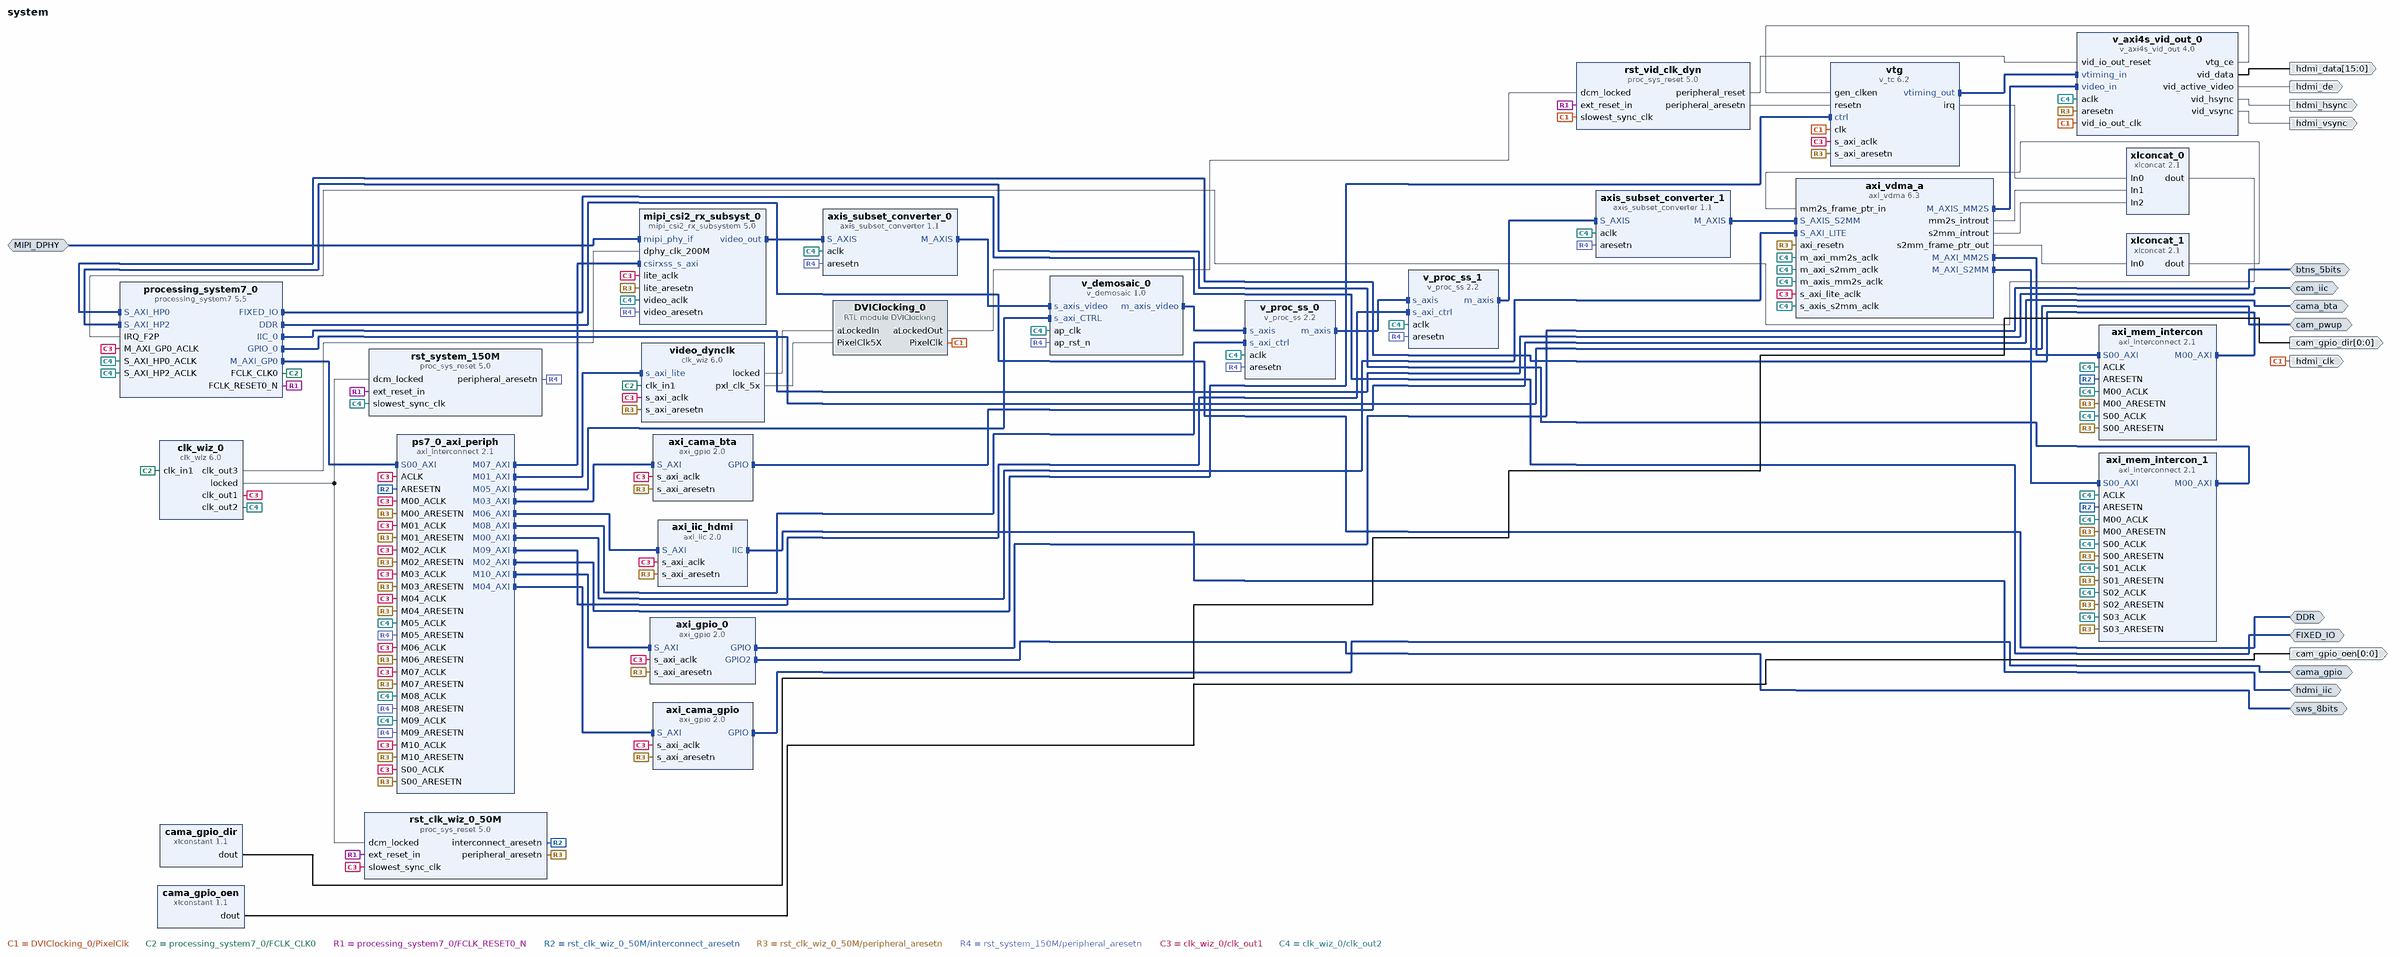
[diagram p0: block diagram of the top level]
# Vivado block design system, xc7z020clg484-1, Vivado 2020.1
create_bd_design system

create_bd_intf_port -mode Master -vlnv xilinx.com:interface:ddrx_rtl:1.0 DDR
create_bd_intf_port -mode Master -vlnv xilinx.com:display_processing_system7:fixedio_rtl:1.0 FIXED_IO
create_bd_intf_port -mode Master -vlnv xilinx.com:interface:iic_rtl:1.0 cam_iic
create_bd_intf_port -mode Master -vlnv xilinx.com:interface:gpio_rtl:1.0 cam_pwup
create_bd_intf_port -mode Master -vlnv xilinx.com:interface:gpio_rtl:1.0 cama_bta
create_bd_intf_port -mode Master -vlnv xilinx.com:interface:gpio_rtl:1.0 cama_gpio
create_bd_intf_port -mode Master -vlnv xilinx.com:interface:iic_rtl:1.0 hdmi_iic
create_bd_intf_port -mode Slave -vlnv xilinx.com:interface:mipi_phy_rtl:1.0 MIPI_DPHY
create_bd_intf_port -mode Master -vlnv xilinx.com:interface:gpio_rtl:1.0 btns_5bits
create_bd_intf_port -mode Master -vlnv xilinx.com:interface:gpio_rtl:1.0 sws_8bits
create_bd_port -dir O -from 0 -to 0 cam_gpio_dir
create_bd_port -dir O -from 0 -to 0 cam_gpio_oen
create_bd_port -dir O -from 15 -to 0 hdmi_data
create_bd_port -dir O hdmi_de
create_bd_port -dir O hdmi_hsync
create_bd_port -dir O hdmi_vsync
create_bd_port -dir O hdmi_clk

create_bd_cell -type module -reference DVIClocking DVIClocking_0
create_bd_cell -type ip -vlnv xilinx.com:ip:processing_system7:5.5 processing_system7_0
set_property -dict [list \
  CONFIG.PCW_APU_PERIPHERAL_FREQMHZ 666.666667 \
  CONFIG.PCW_ENET0_ENET0_IO {MIO 16 .. 27} \
  CONFIG.PCW_ENET0_GRP_MDIO_ENABLE 1 \
  CONFIG.PCW_ENET0_GRP_MDIO_IO {MIO 52 .. 53} \
  CONFIG.PCW_ENET0_PERIPHERAL_ENABLE 1 \
  CONFIG.PCW_ENET_RESET_ENABLE 0 \
  CONFIG.PCW_FPGA0_PERIPHERAL_FREQMHZ 100.000000 \
  CONFIG.PCW_FPGA1_PERIPHERAL_FREQMHZ 150.000000 \
  CONFIG.PCW_GPIO_EMIO_GPIO_ENABLE 1 \
  CONFIG.PCW_GPIO_EMIO_GPIO_IO 2 \
  CONFIG.PCW_GPIO_EMIO_GPIO_WIDTH 2 \
  CONFIG.PCW_GPIO_MIO_GPIO_ENABLE 1 \
  CONFIG.PCW_GPIO_MIO_GPIO_IO MIO \
  CONFIG.PCW_I2C0_I2C0_IO EMIO \
  CONFIG.PCW_I2C0_PERIPHERAL_ENABLE 1 \
  CONFIG.PCW_I2C_PERIPHERAL_FREQMHZ 111.111115 \
  CONFIG.PCW_I2C_RESET_ENABLE 0 \
  CONFIG.PCW_IRQ_F2P_INTR 1 \
  CONFIG.PCW_PERIPHERAL_BOARD_PRESET part0 \
  CONFIG.PCW_PRESET_BANK1_VOLTAGE {LVCMOS 1.8V} \
  CONFIG.PCW_QSPI_GRP_SINGLE_SS_ENABLE 1 \
  CONFIG.PCW_QSPI_GRP_SINGLE_SS_IO {MIO 1 .. 6} \
  CONFIG.PCW_QSPI_PERIPHERAL_ENABLE 1 \
  CONFIG.PCW_QSPI_QSPI_IO {MIO 1 .. 6} \
  CONFIG.PCW_SD0_GRP_CD_ENABLE 1 \
  CONFIG.PCW_SD0_GRP_CD_IO {MIO 47} \
  CONFIG.PCW_SD0_GRP_WP_ENABLE 1 \
  CONFIG.PCW_SD0_GRP_WP_IO {MIO 46} \
  CONFIG.PCW_SD0_PERIPHERAL_ENABLE 1 \
  CONFIG.PCW_SD0_SD0_IO {MIO 40 .. 45} \
  CONFIG.PCW_SDIO_PERIPHERAL_FREQMHZ 100 \
  CONFIG.PCW_SINGLE_QSPI_DATA_MODE x4 \
  CONFIG.PCW_UART1_PERIPHERAL_ENABLE 1 \
  CONFIG.PCW_UART1_UART1_IO {MIO 48 .. 49} \
  CONFIG.PCW_UART_PERIPHERAL_FREQMHZ 50 \
  CONFIG.PCW_UIPARAM_DDR_FREQ_MHZ 533.333313 \
  CONFIG.PCW_UIPARAM_DDR_PARTNO {MT41J128M16 HA-15E} \
  CONFIG.PCW_USB0_PERIPHERAL_ENABLE 1 \
  CONFIG.PCW_USB0_RESET_ENABLE 0 \
  CONFIG.PCW_USB0_USB0_IO {MIO 28 .. 39} \
  CONFIG.PCW_USB_RESET_ENABLE 1 \
  CONFIG.PCW_USB_RESET_SELECT {Share reset pin} \
  CONFIG.PCW_USE_FABRIC_INTERRUPT 1 \
  CONFIG.PCW_USE_S_AXI_HP0 1 \
  CONFIG.PCW_USE_S_AXI_HP2 1 \
  CONFIG.preset ZedBoard \
] [get_bd_cells processing_system7_0]
# 516 more settings of processing_system7_0 are not shown: defaults, MIO pin electricals, DDR timing, and values the tool derives
create_bd_cell -type ip -vlnv xilinx.com:ip:proc_sys_reset:5.0 rst_clk_wiz_0_50M
create_bd_cell -type ip -vlnv xilinx.com:ip:proc_sys_reset:5.0 rst_system_150M
create_bd_cell -type ip -vlnv xilinx.com:ip:proc_sys_reset:5.0 rst_vid_clk_dyn
create_bd_cell -type ip -vlnv xilinx.com:ip:v_axi4s_vid_out:4.0 v_axi4s_vid_out_0
set_property -dict [list \
  CONFIG.C_ADDR_WIDTH 12 \
  CONFIG.C_HAS_ASYNC_CLK 1 \
  CONFIG.C_S_AXIS_VIDEO_FORMAT 0 \
  CONFIG.C_VTG_MASTER_SLAVE 1 \
] [get_bd_cells v_axi4s_vid_out_0]
create_bd_cell -type ip -vlnv xilinx.com:ip:xlconcat:2.1 xlconcat_0
set_property -dict {CONFIG.NUM_PORTS 6 CONFIG.dout_width 6} [get_bd_cells xlconcat_0]
create_bd_cell -type ip -vlnv xilinx.com:ip:xlconcat:2.1 xlconcat_1
set_property -dict {CONFIG.NUM_PORTS 4 CONFIG.dout_width 24} [get_bd_cells xlconcat_1]
create_bd_cell -type ip -vlnv xilinx.com:ip:axi_gpio:2.0 axi_cama_bta
set_property -dict {CONFIG.C_GPIO_WIDTH 4} [get_bd_cells axi_cama_bta]
create_bd_cell -type ip -vlnv xilinx.com:ip:axi_gpio:2.0 axi_cama_gpio
set_property -dict {CONFIG.C_GPIO_WIDTH 4} [get_bd_cells axi_cama_gpio]
create_bd_cell -type ip -vlnv xilinx.com:ip:axi_interconnect:2.1 axi_mem_intercon
set_property -dict {CONFIG.NUM_MI 1 CONFIG.SYNCHRONIZATION_STAGES 2} [get_bd_cells axi_mem_intercon]
create_bd_cell -type ip -vlnv xilinx.com:ip:axi_interconnect:2.1 axi_mem_intercon_1
set_property -dict {CONFIG.NUM_MI 1 CONFIG.NUM_SI 4 CONFIG.SYNCHRONIZATION_STAGES 2} [get_bd_cells axi_mem_intercon_1]
create_bd_cell -type ip -vlnv xilinx.com:ip:axi_vdma:6.3 axi_vdma_a
set_property -dict [list \
  CONFIG.c_enable_mm2s_frmstr_reg 1 \
  CONFIG.c_enable_s2mm_frmstr_reg 1 \
  CONFIG.c_enable_s2mm_sts_reg 1 \
  CONFIG.c_include_mm2s_dre 0 \
  CONFIG.c_include_s2mm 1 \
  CONFIG.c_m_axi_s2mm_data_width 64 \
  CONFIG.c_m_axis_mm2s_tdata_width 16 \
  CONFIG.c_mm2s_genlock_mode 1 \
  CONFIG.c_mm2s_genlock_num_masters 4 \
  CONFIG.c_mm2s_linebuffer_depth 1024 \
  CONFIG.c_num_fstores 3 \
  CONFIG.c_s2mm_genlock_mode 0 \
  CONFIG.c_s2mm_linebuffer_depth 1024 \
] [get_bd_cells axi_vdma_a]
create_bd_cell -type ip -vlnv xilinx.com:ip:xlconstant:1.1 cama_gpio_dir
create_bd_cell -type ip -vlnv xilinx.com:ip:xlconstant:1.1 cama_gpio_oen
set_property -dict {CONFIG.CONST_VAL 0} [get_bd_cells cama_gpio_oen]
create_bd_cell -type ip -vlnv xilinx.com:ip:clk_wiz:6.0 clk_wiz_0
set_property -dict [list \
  CONFIG.CLKOUT1_DRIVES BUFG \
  CONFIG.CLKOUT1_JITTER 174.353 \
  CONFIG.CLKOUT1_PHASE_ERROR 132.063 \
  CONFIG.CLKOUT1_REQUESTED_OUT_FREQ 50 \
  CONFIG.CLKOUT2_DRIVES BUFG \
  CONFIG.CLKOUT2_JITTER 139.594 \
  CONFIG.CLKOUT2_PHASE_ERROR 132.063 \
  CONFIG.CLKOUT2_REQUESTED_OUT_FREQ 150 \
  CONFIG.CLKOUT2_USED true \
  CONFIG.CLKOUT3_DRIVES BUFG \
  CONFIG.CLKOUT3_JITTER 132.221 \
  CONFIG.CLKOUT3_PHASE_ERROR 132.063 \
  CONFIG.CLKOUT3_REQUESTED_OUT_FREQ 200 \
  CONFIG.CLKOUT3_USED true \
  CONFIG.CLKOUT4_DRIVES BUFG \
  CONFIG.CLKOUT5_DRIVES BUFG \
  CONFIG.CLKOUT6_DRIVES BUFG \
  CONFIG.CLKOUT7_DRIVES BUFG \
  CONFIG.CLK_OUT2_PORT clk_out2 \
  CONFIG.CLK_OUT3_PORT clk_out3 \
  CONFIG.MMCM_CLKFBOUT_MULT_F 6.000 \
  CONFIG.MMCM_CLKIN1_PERIOD 10.0 \
  CONFIG.MMCM_CLKIN2_PERIOD 10.0 \
  CONFIG.MMCM_CLKOUT0_DIVIDE_F 12.000 \
  CONFIG.MMCM_CLKOUT1_DIVIDE 4 \
  CONFIG.MMCM_CLKOUT2_DIVIDE 3 \
  CONFIG.MMCM_DIVCLK_DIVIDE 1 \
  CONFIG.NUM_OUT_CLKS 3 \
  CONFIG.PRIM_SOURCE Global_buffer \
  CONFIG.RESET_PORT reset \
  CONFIG.RESET_TYPE ACTIVE_HIGH \
  CONFIG.SECONDARY_SOURCE Single_ended_clock_capable_pin \
  CONFIG.USE_PHASE_ALIGNMENT false \
  CONFIG.USE_RESET false \
] [get_bd_cells clk_wiz_0]
create_bd_cell -type ip -vlnv xilinx.com:ip:axi_interconnect:2.1 ps7_0_axi_periph
set_property -dict [list \
  CONFIG.M06_HAS_REGSLICE 0 \
  CONFIG.M16_HAS_REGSLICE 0 \
  CONFIG.M17_HAS_REGSLICE 0 \
  CONFIG.M18_HAS_REGSLICE 0 \
  CONFIG.NUM_MI 11 \
  CONFIG.S00_HAS_REGSLICE 4 \
  CONFIG.SYNCHRONIZATION_STAGES 2 \
] [get_bd_cells ps7_0_axi_periph]
create_bd_cell -type ip -vlnv xilinx.com:ip:clk_wiz:6.0 video_dynclk
set_property -dict [list \
  CONFIG.CLKOUT1_DRIVES No_buffer \
  CONFIG.CLKOUT1_JITTER 232.529 \
  CONFIG.CLKOUT1_PHASE_ERROR 322.999 \
  CONFIG.CLKOUT1_REQUESTED_OUT_FREQ 742.5 \
  CONFIG.CLKOUT2_DRIVES BUFG \
  CONFIG.CLKOUT3_DRIVES BUFG \
  CONFIG.CLKOUT4_DRIVES BUFG \
  CONFIG.CLKOUT5_DRIVES BUFG \
  CONFIG.CLKOUT6_DRIVES BUFG \
  CONFIG.CLKOUT7_DRIVES BUFG \
  CONFIG.CLK_OUT1_PORT pxl_clk_5x \
  CONFIG.FEEDBACK_SOURCE FDBK_ONCHIP \
  CONFIG.MMCM_CLKFBOUT_MULT_F 37.125 \
  CONFIG.MMCM_CLKIN1_PERIOD 10.000 \
  CONFIG.MMCM_CLKIN2_PERIOD 10.000 \
  CONFIG.MMCM_CLKOUT0_DIVIDE_F 1.000 \
  CONFIG.MMCM_DIVCLK_DIVIDE 5 \
  CONFIG.PRIM_SOURCE No_buffer \
  CONFIG.SECONDARY_SOURCE Single_ended_clock_capable_pin \
  CONFIG.USE_DYN_RECONFIG true \
  CONFIG.USE_FREQ_SYNTH true \
  CONFIG.USE_PHASE_ALIGNMENT false \
] [get_bd_cells video_dynclk]
create_bd_cell -type ip -vlnv xilinx.com:ip:v_tc:6.2 vtg
set_property -dict {CONFIG.VIDEO_MODE 1080p CONFIG.enable_detection false} [get_bd_cells vtg]
create_bd_cell -type ip -vlnv xilinx.com:ip:axi_iic:2.0 axi_iic_hdmi
create_bd_cell -type ip -vlnv xilinx.com:ip:axis_subset_converter:1.1 axis_subset_converter_0
set_property -dict [list \
  CONFIG.M_TDATA_NUM_BYTES 1 \
  CONFIG.M_TDEST_WIDTH 1 \
  CONFIG.S_TDATA_NUM_BYTES 2 \
  CONFIG.TDATA_REMAP {tdata[9:2]} \
  CONFIG.TDEST_REMAP {tdest[0:0]} \
] [get_bd_cells axis_subset_converter_0]
create_bd_cell -type ip -vlnv xilinx.com:ip:mipi_csi2_rx_subsystem:5.0 mipi_csi2_rx_subsyst_0
set_property -dict [list \
  CONFIG.CMN_NUM_LANES 2 \
  CONFIG.CMN_PXL_FORMAT RAW10 \
  CONFIG.C_DPHY_LANES 2 \
  CONFIG.C_HS_LINE_RATE 420 \
  CONFIG.C_HS_SETTLE_NS 158 \
  CONFIG.DPY_EN_REG_IF true \
  CONFIG.DPY_LINE_RATE 420 \
] [get_bd_cells mipi_csi2_rx_subsyst_0]
create_bd_cell -type ip -vlnv xilinx.com:ip:v_demosaic:1.0 v_demosaic_0
set_property -dict {CONFIG.ALGORITHM 1 CONFIG.ENABLE_ZIPPER_REMOVAL false} [get_bd_cells v_demosaic_0]
create_bd_cell -type ip -vlnv xilinx.com:ip:v_proc_ss:2.2 v_proc_ss_0
set_property -dict [list \
  CONFIG.C_COLORSPACE_SUPPORT 2 \
  CONFIG.C_CSC_ENABLE_WINDOW false \
  CONFIG.C_MAX_DATA_WIDTH 8 \
  CONFIG.C_SAMPLES_PER_CLK 1 \
  CONFIG.C_TOPOLOGY 3 \
] [get_bd_cells v_proc_ss_0]
create_bd_cell -type ip -vlnv xilinx.com:ip:v_proc_ss:2.2 v_proc_ss_1
set_property -dict [list \
  CONFIG.C_H_CHROMA_ALGORITHM 0 \
  CONFIG.C_MAX_DATA_WIDTH 8 \
  CONFIG.C_SAMPLES_PER_CLK 1 \
  CONFIG.C_TOPOLOGY 5 \
] [get_bd_cells v_proc_ss_1]
create_bd_cell -type ip -vlnv xilinx.com:ip:axis_subset_converter:1.1 axis_subset_converter_1
set_property -dict [list \
  CONFIG.M_TDATA_NUM_BYTES 2 \
  CONFIG.S_TDATA_NUM_BYTES 3 \
  CONFIG.TDATA_REMAP {tdata[15:0]} \
] [get_bd_cells axis_subset_converter_1]
create_bd_cell -type ip -vlnv xilinx.com:ip:axi_gpio:2.0 axi_gpio_0
set_property -dict [list \
  CONFIG.GPIO2_BOARD_INTERFACE sws_8bits \
  CONFIG.GPIO_BOARD_INTERFACE btns_5bits \
  CONFIG.USE_BOARD_FLOW true \
] [get_bd_cells axi_gpio_0]

# ---- connections ----

connect_bd_intf_net [get_bd_intf_pins ps7_0_axi_periph/M06_AXI] [get_bd_intf_pins axi_iic_hdmi/S_AXI]
connect_bd_intf_net [get_bd_intf_ports cama_bta] [get_bd_intf_pins axi_cama_bta/GPIO]
connect_bd_intf_net [get_bd_intf_pins axi_vdma_a/S_AXI_LITE] [get_bd_intf_pins ps7_0_axi_periph/M00_AXI]
connect_bd_intf_net [get_bd_intf_pins axis_subset_converter_1/M_AXIS] [get_bd_intf_pins axi_vdma_a/S_AXIS_S2MM]
connect_bd_intf_net [get_bd_intf_pins axis_subset_converter_0/M_AXIS] [get_bd_intf_pins v_demosaic_0/s_axis_video]
connect_bd_intf_net [get_bd_intf_ports FIXED_IO] [get_bd_intf_pins processing_system7_0/FIXED_IO]
connect_bd_intf_net [get_bd_intf_pins mipi_csi2_rx_subsyst_0/video_out] [get_bd_intf_pins axis_subset_converter_0/S_AXIS]
connect_bd_intf_net [get_bd_intf_pins ps7_0_axi_periph/M03_AXI] [get_bd_intf_pins axi_cama_bta/S_AXI]
connect_bd_intf_net -intf_net axi_vdma_0_M_AXI_S2MM [get_bd_intf_pins axi_mem_intercon_1/S00_AXI] [get_bd_intf_pins axi_vdma_a/M_AXI_S2MM]
connect_bd_intf_net [get_bd_intf_pins v_proc_ss_1/s_axi_ctrl] [get_bd_intf_pins ps7_0_axi_periph/M09_AXI]
connect_bd_intf_net [get_bd_intf_ports DDR] [get_bd_intf_pins processing_system7_0/DDR]
connect_bd_intf_net [get_bd_intf_pins v_proc_ss_0/s_axi_ctrl] [get_bd_intf_pins ps7_0_axi_periph/M08_AXI]
connect_bd_intf_net [get_bd_intf_ports cam_iic] [get_bd_intf_pins processing_system7_0/IIC_0]
connect_bd_intf_net -intf_net axi_vdma_0_M_AXI_MM2S [get_bd_intf_pins axi_mem_intercon/S00_AXI] [get_bd_intf_pins axi_vdma_a/M_AXI_MM2S]
connect_bd_intf_net [get_bd_intf_pins axi_mem_intercon/M00_AXI] [get_bd_intf_pins processing_system7_0/S_AXI_HP0]
connect_bd_intf_net -intf_net v_tc_0_vtiming_out [get_bd_intf_pins v_axi4s_vid_out_0/vtiming_in] [get_bd_intf_pins vtg/vtiming_out]
connect_bd_intf_net -intf_net axi_iic_0_IIC [get_bd_intf_ports hdmi_iic] [get_bd_intf_pins axi_iic_hdmi/IIC]
connect_bd_intf_net [get_bd_intf_ports cam_pwup] [get_bd_intf_pins processing_system7_0/GPIO_0]
connect_bd_intf_net -intf_net axi_vdma_0_M_AXIS_MM2S [get_bd_intf_pins axi_vdma_a/M_AXIS_MM2S] [get_bd_intf_pins v_axi4s_vid_out_0/video_in]
connect_bd_intf_net [get_bd_intf_pins ps7_0_axi_periph/M04_AXI] [get_bd_intf_pins axi_cama_gpio/S_AXI]
connect_bd_intf_net [get_bd_intf_pins processing_system7_0/M_AXI_GP0] [get_bd_intf_pins ps7_0_axi_periph/S00_AXI]
connect_bd_intf_net [get_bd_intf_pins axi_mem_intercon_1/M00_AXI] [get_bd_intf_pins processing_system7_0/S_AXI_HP2]
connect_bd_intf_net [get_bd_intf_pins ps7_0_axi_periph/M01_AXI] [get_bd_intf_pins video_dynclk/s_axi_lite]
connect_bd_intf_net [get_bd_intf_pins v_demosaic_0/s_axi_CTRL] [get_bd_intf_pins ps7_0_axi_periph/M05_AXI]
connect_bd_intf_net [get_bd_intf_pins v_proc_ss_1/m_axis] [get_bd_intf_pins axis_subset_converter_1/S_AXIS]
connect_bd_intf_net [get_bd_intf_pins v_demosaic_0/m_axis_video] [get_bd_intf_pins v_proc_ss_0/s_axis]
connect_bd_intf_net [get_bd_intf_pins ps7_0_axi_periph/M07_AXI] [get_bd_intf_pins mipi_csi2_rx_subsyst_0/csirxss_s_axi]
connect_bd_intf_net [get_bd_intf_pins ps7_0_axi_periph/M02_AXI] [get_bd_intf_pins vtg/ctrl]
connect_bd_intf_net [get_bd_intf_pins v_proc_ss_0/m_axis] [get_bd_intf_pins v_proc_ss_1/s_axis]
connect_bd_intf_net [get_bd_intf_ports cama_gpio] [get_bd_intf_pins axi_cama_gpio/GPIO]
connect_bd_intf_net -intf_net mipi_phy_if_0_1 [get_bd_intf_ports MIPI_DPHY] [get_bd_intf_pins mipi_csi2_rx_subsyst_0/mipi_phy_if]
connect_bd_intf_net [get_bd_intf_pins ps7_0_axi_periph/M10_AXI] [get_bd_intf_pins axi_gpio_0/S_AXI]
connect_bd_intf_net [get_bd_intf_ports btns_5bits] [get_bd_intf_pins axi_gpio_0/GPIO]
connect_bd_intf_net [get_bd_intf_ports sws_8bits] [get_bd_intf_pins axi_gpio_0/GPIO2]
connect_bd_net [get_bd_pins DVIClocking_0/aLockedOut] [get_bd_pins rst_vid_clk_dyn/dcm_locked]
connect_bd_net -net PixelClk_Generator_clk_out1 [get_bd_pins DVIClocking_0/PixelClk] \
  [get_bd_pins rst_vid_clk_dyn/slowest_sync_clk] [get_bd_pins v_axi4s_vid_out_0/vid_io_out_clk] [get_bd_pins vtg/clk] \
  [get_bd_ports hdmi_clk]
connect_bd_net -net axi_vdma_0_mm2s_introut [get_bd_pins axi_vdma_a/mm2s_introut] [get_bd_pins xlconcat_0/In1]
connect_bd_net -net axi_vdma_0_s2mm_introut [get_bd_pins axi_vdma_a/s2mm_introut] [get_bd_pins xlconcat_0/In2]
connect_bd_net [get_bd_pins axi_vdma_a/s2mm_frame_ptr_out] [get_bd_pins xlconcat_1/In0]
connect_bd_net [get_bd_pins cama_gpio_dir/dout] [get_bd_ports cam_gpio_dir]
connect_bd_net [get_bd_pins cama_gpio_oen/dout] [get_bd_ports cam_gpio_oen]
connect_bd_net [get_bd_pins clk_wiz_0/locked] [get_bd_pins rst_clk_wiz_0_50M/dcm_locked] [get_bd_pins rst_system_150M/dcm_locked]
connect_bd_net -net clk_wiz_1_locked [get_bd_pins video_dynclk/locked] [get_bd_pins DVIClocking_0/aLockedIn]
connect_bd_net -net clk_wiz_1_pxl_clk_5x [get_bd_pins video_dynclk/pxl_clk_5x] [get_bd_pins DVIClocking_0/PixelClk5X]
connect_bd_net [get_bd_pins processing_system7_0/FCLK_CLK0] [get_bd_pins clk_wiz_0/clk_in1] [get_bd_pins video_dynclk/clk_in1]
connect_bd_net [get_bd_pins processing_system7_0/FCLK_RESET0_N] \
  [get_bd_pins rst_clk_wiz_0_50M/ext_reset_in] [get_bd_pins rst_system_150M/ext_reset_in] \
  [get_bd_pins rst_vid_clk_dyn/ext_reset_in]
connect_bd_net [get_bd_pins rst_clk_wiz_0_50M/interconnect_aresetn] \
  [get_bd_pins axi_mem_intercon/ARESETN] [get_bd_pins axi_mem_intercon_1/ARESETN] [get_bd_pins ps7_0_axi_periph/ARESETN]
connect_bd_net [get_bd_pins rst_clk_wiz_0_50M/peripheral_aresetn] \
  [get_bd_pins v_axi4s_vid_out_0/aresetn] [get_bd_pins axi_cama_bta/s_axi_aresetn] [get_bd_pins axi_cama_gpio/s_axi_aresetn] \
  [get_bd_pins axi_mem_intercon/S00_ARESETN] [get_bd_pins axi_mem_intercon/M00_ARESETN] \
  [get_bd_pins axi_mem_intercon_1/S00_ARESETN] [get_bd_pins axi_mem_intercon_1/S01_ARESETN] \
  [get_bd_pins axi_mem_intercon_1/S02_ARESETN] [get_bd_pins axi_mem_intercon_1/S03_ARESETN] \
  [get_bd_pins axi_mem_intercon_1/M00_ARESETN] [get_bd_pins axi_vdma_a/axi_resetn] [get_bd_pins ps7_0_axi_periph/S00_ARESETN] \
  [get_bd_pins ps7_0_axi_periph/M00_ARESETN] [get_bd_pins ps7_0_axi_periph/M01_ARESETN] \
  [get_bd_pins ps7_0_axi_periph/M02_ARESETN] [get_bd_pins ps7_0_axi_periph/M03_ARESETN] \
  [get_bd_pins ps7_0_axi_periph/M04_ARESETN] [get_bd_pins video_dynclk/s_axi_aresetn] [get_bd_pins vtg/s_axi_aresetn] \
  [get_bd_pins axi_iic_hdmi/s_axi_aresetn] [get_bd_pins ps7_0_axi_periph/M06_ARESETN] \
  [get_bd_pins mipi_csi2_rx_subsyst_0/lite_aresetn] [get_bd_pins ps7_0_axi_periph/M07_ARESETN] \
  [get_bd_pins axi_gpio_0/s_axi_aresetn] [get_bd_pins ps7_0_axi_periph/M10_ARESETN]
connect_bd_net [get_bd_pins rst_system_150M/peripheral_aresetn] \
  [get_bd_pins axis_subset_converter_0/aresetn] [get_bd_pins ps7_0_axi_periph/M05_ARESETN] \
  [get_bd_pins mipi_csi2_rx_subsyst_0/video_aresetn] [get_bd_pins v_demosaic_0/ap_rst_n] [get_bd_pins v_proc_ss_0/aresetn] \
  [get_bd_pins v_proc_ss_1/aresetn] [get_bd_pins ps7_0_axi_periph/M08_ARESETN] [get_bd_pins ps7_0_axi_periph/M09_ARESETN] \
  [get_bd_pins axis_subset_converter_1/aresetn]
connect_bd_net [get_bd_pins rst_vid_clk_dyn/peripheral_aresetn] [get_bd_pins vtg/resetn]
connect_bd_net [get_bd_pins rst_vid_clk_dyn/peripheral_reset] [get_bd_pins v_axi4s_vid_out_0/vid_io_out_reset]
connect_bd_net -net s_axil_clk_50 [get_bd_pins clk_wiz_0/clk_out1] \
  [get_bd_pins processing_system7_0/M_AXI_GP0_ACLK] [get_bd_pins rst_clk_wiz_0_50M/slowest_sync_clk] \
  [get_bd_pins axi_cama_bta/s_axi_aclk] [get_bd_pins axi_cama_gpio/s_axi_aclk] [get_bd_pins axi_vdma_a/s_axi_lite_aclk] \
  [get_bd_pins ps7_0_axi_periph/ACLK] [get_bd_pins ps7_0_axi_periph/S00_ACLK] [get_bd_pins ps7_0_axi_periph/M00_ACLK] \
  [get_bd_pins ps7_0_axi_periph/M01_ACLK] [get_bd_pins ps7_0_axi_periph/M02_ACLK] [get_bd_pins ps7_0_axi_periph/M03_ACLK] \
  [get_bd_pins ps7_0_axi_periph/M04_ACLK] [get_bd_pins video_dynclk/s_axi_aclk] [get_bd_pins vtg/s_axi_aclk] \
  [get_bd_pins axi_iic_hdmi/s_axi_aclk] [get_bd_pins ps7_0_axi_periph/M06_ACLK] \
  [get_bd_pins mipi_csi2_rx_subsyst_0/lite_aclk] [get_bd_pins ps7_0_axi_periph/M07_ACLK] [get_bd_pins axi_gpio_0/s_axi_aclk] \
  [get_bd_pins ps7_0_axi_periph/M10_ACLK]
connect_bd_net [get_bd_pins v_axi4s_vid_out_0/vtg_ce] [get_bd_pins vtg/gen_clken]
connect_bd_net -net v_tc_0_irq [get_bd_pins vtg/irq] [get_bd_pins xlconcat_0/In0]
connect_bd_net [get_bd_pins xlconcat_0/dout] [get_bd_pins processing_system7_0/IRQ_F2P]
connect_bd_net [get_bd_pins xlconcat_1/dout] [get_bd_pins axi_vdma_a/mm2s_frame_ptr_in]
connect_bd_net [get_bd_pins v_axi4s_vid_out_0/vid_data] [get_bd_ports hdmi_data]
connect_bd_net [get_bd_pins v_axi4s_vid_out_0/vid_active_video] [get_bd_ports hdmi_de]
connect_bd_net [get_bd_pins v_axi4s_vid_out_0/vid_hsync] [get_bd_ports hdmi_hsync]
connect_bd_net [get_bd_pins v_axi4s_vid_out_0/vid_vsync] [get_bd_ports hdmi_vsync]
connect_bd_net [get_bd_pins clk_wiz_0/clk_out3] [get_bd_pins mipi_csi2_rx_subsyst_0/dphy_clk_200M]
connect_bd_net -net mm_clk_150 [get_bd_pins clk_wiz_0/clk_out2] \
  [get_bd_pins processing_system7_0/S_AXI_HP0_ACLK] [get_bd_pins processing_system7_0/S_AXI_HP2_ACLK] \
  [get_bd_pins rst_system_150M/slowest_sync_clk] [get_bd_pins v_axi4s_vid_out_0/aclk] [get_bd_pins axi_mem_intercon/ACLK] \
  [get_bd_pins axi_mem_intercon/S00_ACLK] [get_bd_pins axi_mem_intercon/M00_ACLK] [get_bd_pins axi_mem_intercon_1/ACLK] \
  [get_bd_pins axi_mem_intercon_1/S00_ACLK] [get_bd_pins axi_mem_intercon_1/S01_ACLK] \
  [get_bd_pins axi_mem_intercon_1/S02_ACLK] [get_bd_pins axi_mem_intercon_1/S03_ACLK] \
  [get_bd_pins axi_mem_intercon_1/M00_ACLK] [get_bd_pins axi_vdma_a/m_axi_mm2s_aclk] \
  [get_bd_pins axi_vdma_a/m_axis_mm2s_aclk] [get_bd_pins axi_vdma_a/m_axi_s2mm_aclk] \
  [get_bd_pins axi_vdma_a/s_axis_s2mm_aclk] [get_bd_pins axis_subset_converter_0/aclk] \
  [get_bd_pins ps7_0_axi_periph/M05_ACLK] [get_bd_pins mipi_csi2_rx_subsyst_0/video_aclk] [get_bd_pins v_demosaic_0/ap_clk] \
  [get_bd_pins v_proc_ss_0/aclk] [get_bd_pins v_proc_ss_1/aclk] [get_bd_pins ps7_0_axi_periph/M08_ACLK] \
  [get_bd_pins ps7_0_axi_periph/M09_ACLK] [get_bd_pins axis_subset_converter_1/aclk]

# ---- address map ----
assign_bd_address -offset 0x00000000 -range 512M -target_address_space [get_bd_addr_spaces axi_vdma_a/Data_MM2S] [get_bd_addr_segs processing_system7_0/S_AXI_HP0/HP0_DDR_LOWOCM]
assign_bd_address -offset 0x00000000 -range 512M -target_address_space [get_bd_addr_spaces axi_vdma_a/Data_S2MM] [get_bd_addr_segs processing_system7_0/S_AXI_HP2/HP2_DDR_LOWOCM]
assign_bd_address -offset 0x41200000 -range 64K -target_address_space [get_bd_addr_spaces processing_system7_0/Data] [get_bd_addr_segs axi_cama_bta/S_AXI/Reg]
assign_bd_address -offset 0x41210000 -range 64K -target_address_space [get_bd_addr_spaces processing_system7_0/Data] [get_bd_addr_segs axi_cama_gpio/S_AXI/Reg]
assign_bd_address -offset 0x41220000 -range 64K -target_address_space [get_bd_addr_spaces processing_system7_0/Data] [get_bd_addr_segs axi_gpio_0/S_AXI/Reg]
assign_bd_address -offset 0x41600000 -range 64K -target_address_space [get_bd_addr_spaces processing_system7_0/Data] [get_bd_addr_segs axi_iic_hdmi/S_AXI/Reg]
assign_bd_address -offset 0x43000000 -range 64K -target_address_space [get_bd_addr_spaces processing_system7_0/Data] [get_bd_addr_segs axi_vdma_a/S_AXI_LITE/Reg]
assign_bd_address -offset 0x43C00000 -range 64K -target_address_space [get_bd_addr_spaces processing_system7_0/Data] [get_bd_addr_segs video_dynclk/s_axi_lite/Reg]
assign_bd_address -offset 0x43C10000 -range 64K -target_address_space [get_bd_addr_spaces processing_system7_0/Data] [get_bd_addr_segs vtg/ctrl/Reg]
assign_bd_address -offset 0x43C20000 -range 8K -target_address_space [get_bd_addr_spaces processing_system7_0/Data] [get_bd_addr_segs mipi_csi2_rx_subsyst_0/csirxss_s_axi/Reg]
assign_bd_address -offset 0x43C30000 -range 64K -target_address_space [get_bd_addr_spaces processing_system7_0/Data] [get_bd_addr_segs v_proc_ss_0/s_axi_ctrl/Reg]
assign_bd_address -offset 0x43C40000 -range 64K -target_address_space [get_bd_addr_spaces processing_system7_0/Data] [get_bd_addr_segs v_proc_ss_1/s_axi_ctrl/Reg]
assign_bd_address -offset 0x43C50000 -range 64K -target_address_space [get_bd_addr_spaces processing_system7_0/Data] [get_bd_addr_segs v_demosaic_0/s_axi_CTRL/Reg]

validate_bd_design
save_bd_design
